# Altium project MainBoard.PrjPCB
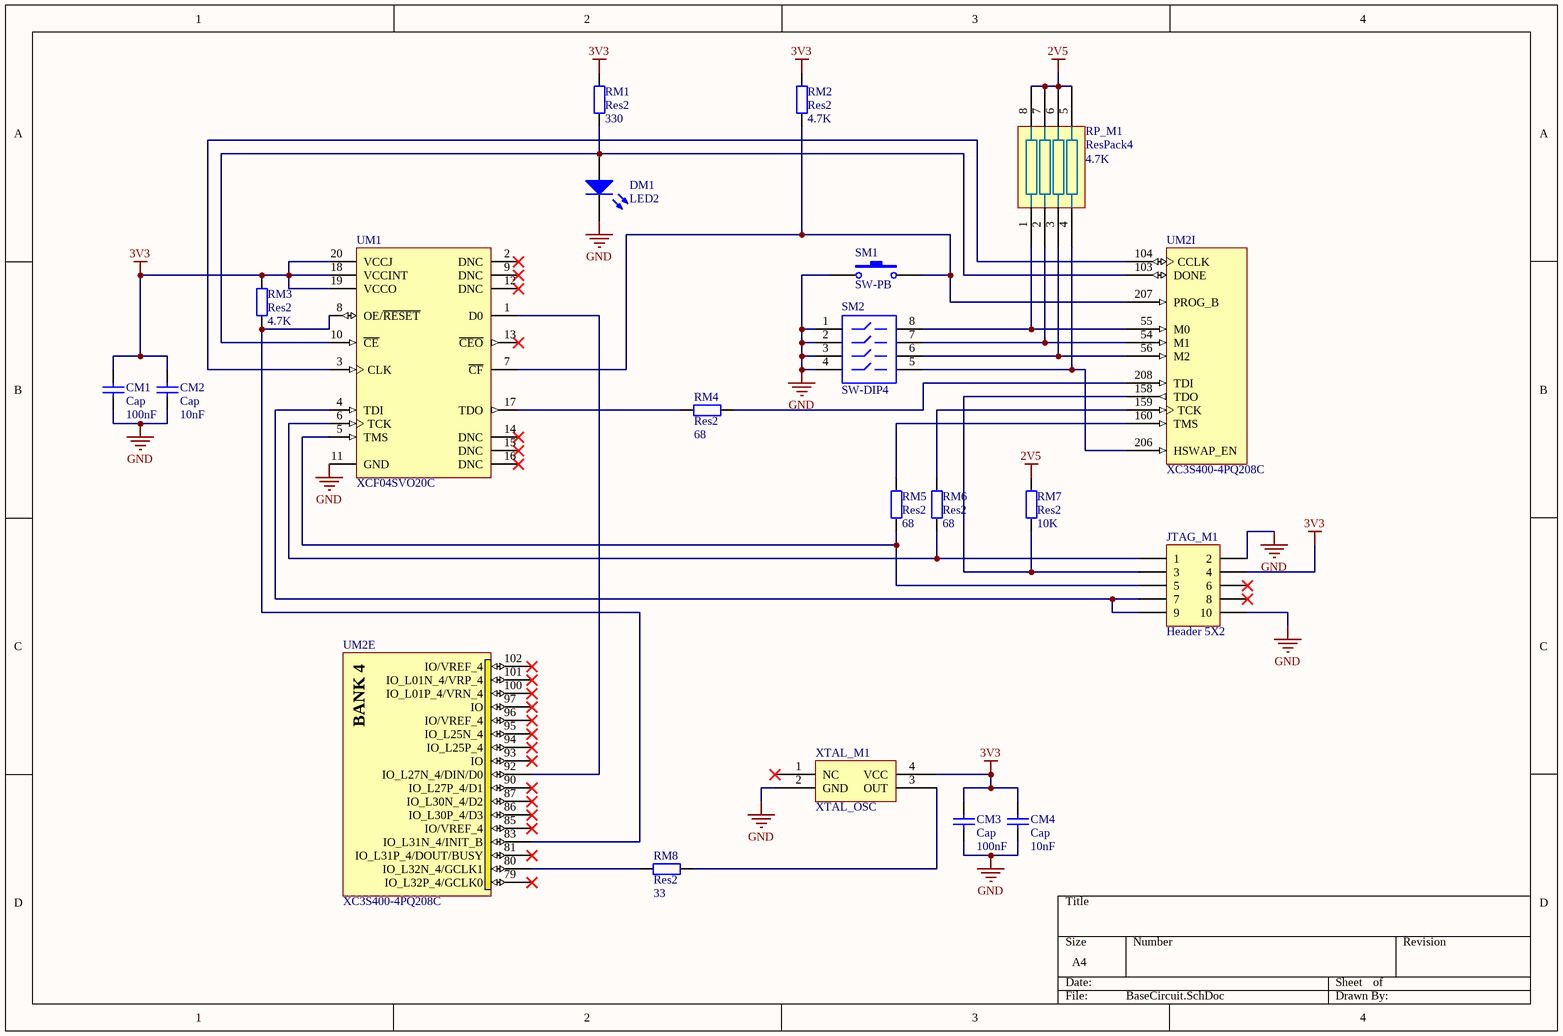
[diagram p0: BaseCircuit.SchDoc]
4 sheets, 81 parts. Net scope: global (net labels, ports and power ports of the same name join across sheets).
Board file: MainBoard4.PcbDoc
Sheets:
  BaseCircuit.SchDoc
  Banks.SchDoc
  PowerGnd.SchDoc
  Supply.SchDoc

## Sheet BaseCircuit.SchDoc
size A4; SheetNumber: 1

### Parts
CM1  Cap  value 100nF  [C0805]
CM2  Cap  value 10nF  [C0805]
CM3  Cap  value 100nF  [C0805]
CM4  Cap  value 10nF  [C0805]
DM1  LED2  [3.2X1.6X1.1]
JTAG_M1  Header 5X2  [HDR2X5]
RM1  Res2  value 330  [6-0805_N]
RM2  Res2  value 4.7K  [6-0805_N]
RM3  Res2  value 4.7K  [6-0805_N]
RM4  Res2  value 68  [6-0805_N]
RM5  Res2  value 68  [6-0805_N]
RM6  Res2  value 68  [6-0805_N]
RM7  Res2  value 10K  [6-0805_N]
RM8  Res2  value 33  [6-0805_N]
RP_M1  ResPack4  value 4.7K  [SSOP8]
SM1  SW-PB  [SPST-2]
SM2  SW-DIP4  [DIP-8]
UM1  XCF04SVO20C  [VO20_N]
UM2  XC3S400-4PQ208C  [PQ208_N]  (parts E,I of 11)
XTAL_M1  XTAL_OSC  [XTAL_HALF]

### Nets
2V5: RM7.2 RP_M1.5 RP_M1.6 RP_M1.7 RP_M1.8
3V3: CM1.2 CM2.2 CM3.2 CM4.2 JTAG_M1.4 RM1.2 RM2.2 RM3.2 UM1.18(VCCINT) UM1.19(VCCO) UM1.20(VCCJ) XTAL_M1.4(VCC)
GND: CM1.1 CM2.1 CM3.1 CM4.1 DM1.2(K) JTAG_M1.2 JTAG_M1.10 SM1.1 SM2.1 SM2.2 SM2.3 SM2.4 UM1.11(GND) XTAL_M1.2(GND)
NetDM1_1: DM1.1(A) RM1.1 UM1.10(~{CE}) UM2.103(DONE)
NetJTAG_M1_1: JTAG_M1.1 RM6.1 UM1.6(TCK)
NetJTAG_M1_3: JTAG_M1.3 RM7.1 UM2.158(TDO)
NetJTAG_M1_5: JTAG_M1.5 RM5.1 UM1.5(TMS)
NetJTAG_M1_7: JTAG_M1.7 JTAG_M1.9 UM1.4(TDI)
NetRM2_1: RM2.1 SM1.2 UM1.7(~{CF}) UM2.207(PROG_B)
NetRM3_1: RM3.1 UM1.8(OE/~{RESET}) UM2.83(IO_L31N_4/INIT_B)
NetRM4_1: RM4.1 UM2.208(TDI)
NetRM4_2: RM4.2 UM1.17(TDO)
NetRM5_2: RM5.2 UM2.160(TMS)
NetRM6_2: RM6.2 UM2.159(TCK)
NetRM8_1: RM8.1 XTAL_M1.3(OUT)
NetRM8_2: RM8.2 UM2.80(IO_L32N_4/GCLK1)
NetRP_M1_1: RP_M1.1 SM2.8 UM2.55(M0)
NetRP_M1_2: RP_M1.2 SM2.7 UM2.54(M1)
NetRP_M1_3: RP_M1.3 SM2.6 UM2.56(M2)
NetRP_M1_4: RP_M1.4 SM2.5 UM2.206(HSWAP_EN)
NetUM1_1: UM1.1(D0) UM2.92(IO_L27N_4/DIN/D0)
NetUM1_3: UM1.3(CLK) UM2.104(CCLK)

Not connected (* = marked no-connect by the designer): JTAG_M1 6* 8*; UM1 2(DNC)* 9(DNC)* 12(DNC)* 13(~{CEO})* 14(DNC)* 15(DNC)* 16(DNC)*; UM2 79(IO_L32P_4/GCLK0)* 81(IO_L31P_4/DOUT/BUSY)* 85(IO/VREF_4)* 86(IO_L30P_4/D3)* 87(IO_L30N_4/D2)* 90(IO_L27P_4/D1)* 93(IO)* 94(IO_L25P_4)* 95(IO_L25N_4)* 96(IO/VREF_4)* 97(IO)* 100(IO_L01P_4/VRN_4)* 101(IO_L01N_4/VRP_4)* 102(IO/VREF_4)*; XTAL_M1 1(NC)*

### Notes on the sheet
- (in symbol XC3S400-4PQ208C, part E) BANK 4

### Library data of the parts
CM1-CM4 = Cap: Capacitor; Published: 8-Jun-2000; LatestRevisionDate: 17-Jul-2002; LatestRevisionNote: Re-released for DXP Platform.; PackageReference: RAD-0.3; Publisher: Altium Limited; PackageDescription: Radial Cap, Thru-Hole; 2 Leads; 0.3 in Pin Spacing
DM1 = LED2: Typical RED, GREEN, YELLOW, AMBER GaAs LED; Published: 8-Jun-2000; LatestRevisionDate: 17-Jul-2002; LatestRevisionNote: Re-released for DXP Platform.; PackageVersion: Feb-2002; PackageReference: 3.2X1.6X1.1; Publisher: Altium Limited; PackageDescription: SM LED; 2 Flat Leads
JTAG_M1 = Header 5X2: Header, 5-Pin, Dual row; LatestRevisionDate: 17-Jul-2002; LatestRevisionNote: Re-released for DXP Platform.; Publisher: Altium Limited
RM1-RM8 = Res2: Resistor; Published: 8-Jun-2000; LatestRevisionDate: 17-Jul-2002; LatestRevisionNote: Re-released for DXP Platform.; PackageReference: AXIAL-0.4; Publisher: Altium Limited; PackageDescription: Axial Device, Thru-Hole; 2 Leads; 0.4 in Pin Spacing
SM1 = SW-PB: Switch; Published: 24-Mar-1999; LatestRevisionDate: 17-Jul-2002; LatestRevisionNote: Re-released for DXP Platform.; PackageReference: SPST-2; Publisher: Altium Limited; PackageDescription: Switch; 2 Leads
SM2 = SW-DIP4: DIP Switch; Published: 24-Mar-1999; LatestRevisionDate: 17-Jul-2002; LatestRevisionNote: Re-released for DXP Platform.; PackageReference: DIP-8; Publisher: Altium Limited
UM1 = XCF04SVO20C: XCF00S Series, Platform Flash In-System Programmable Configuration 3.3V PROM, 20-Pin TSOP, 4-Megabit, Commercial Grade; Published: 17-Sep-2003; LatestRevisionDate: 16-Nov-2009; LatestRevisionNote: Updated to datasheet version 2.17, Oct-2009.; DatasheetVersion: ver2.17, Oct-2009; PackageVersion: ver1.3, Dec-2008; PackageReference: VO20; Publisher: Altium Limited; PackageDescription: 20-Pin Thin Shrink Small Outline Package (VO20); Supplier 1: Digi-Key; Supplier Part Number 1: XCF04SVO20C-ND; Code_JEDEC: MO-153-AC; ComponentLink1Description: Platform Flash Datasheet; ComponentLink1URL: http://www.xilinx.com/support/documentation/data_sheets/ds123.pdf; ComponentLink2Description: VO20 Package Drawing; ComponentLink2URL: http://www.xilinx.com/support/documentation/package_specs/vo20.pdf; ComponentLink3Description: Configuration PROM Documents; ComponentLink3URL: http://www.xilinx.com/support/documentation/configuration_proms.htm; ComponentLink4Description: Xilinx.com Home; ComponentLink4URL: http://www.xilinx.com
UM2 = XC3S400-4PQ208C: Spartan-3 1.2V FPGA, 141 User I/Os, 208-Pin PQFP, Standard Performance, Commercial Grade; OrderingInformation: Additional code may have to be appended for different mask revision devices.; Published: 17-Sep-2003; LatestRevisionDate: 01-Mar-2010; LatestRevisionNote: Updated to datasheet version 2.5 Dec-2009.; DatasheetVersion: ver2.5, Dec-2009; PackageVersion: ver1.2, Jun-2004; PackageReference: PQ208; Publisher: Altium Limited; PackageDescription: 208-Pin Plastic Quad Flat Pack (PQ208); Supplier 1: Digi-Key; Supplier Part Number 1: XC3S400-4PQ208C-ND; Code_JEDEC: MS-029-FA-1; ComponentLink1Description: Spartan-3 Datasheet; ComponentLink1URL: http://www.xilinx.com/support/documentation/data_sheets/ds099.pdf; ComponentLink2Description: PQ208 Package Drawing; ComponentLink2URL: http://www.xilinx.com/support/documentation/package_specs/pq208.pdf; ComponentLink3Description: Spartan-3 Documents; ComponentLink3URL: http://www.xilinx.com/support/documentation/spartan-3.htm; ComponentLink4Description: Xilinx.com Home; ComponentLink4URL: http://www.xilinx.com

## Sheet Banks.SchDoc
size A4; SheetNumber: 2; SheetTotal: 4
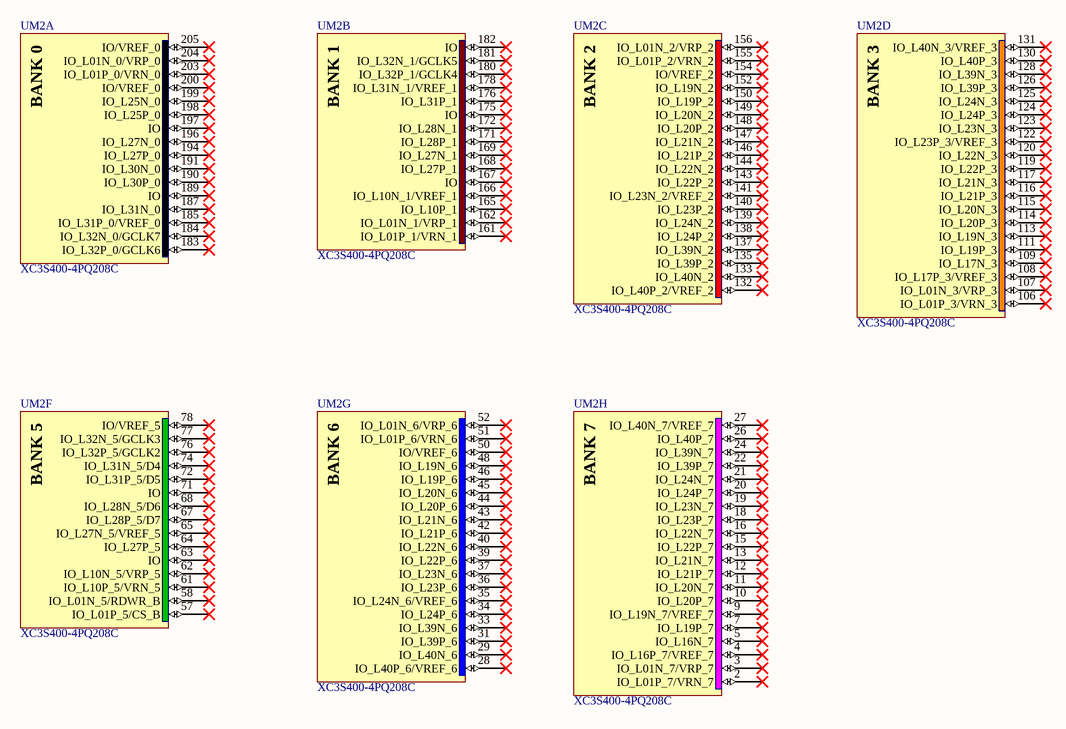
[diagram p1: Banks.SchDoc]

### Parts
UM2  XC3S400-4PQ208C  [PQ208_N]  (parts A,B,C,D,F,G,H of 11)

### Nets

Not connected (* = marked no-connect by the designer): UM2 2(IO_L01P_7/VRN_7)* 3(IO_L01N_7/VRP_7)* 4(IO_L16P_7/VREF_7)* 5(IO_L16N_7)* 7(IO_L19P_7)* 9(IO_L19N_7/VREF_7)* 10(IO_L20P_7)* 11(IO_L20N_7)* 12(IO_L21P_7)* 13(IO_L21N_7)* 15(IO_L22P_7)* 16(IO_L22N_7)* 18(IO_L23P_7)* 19(IO_L23N_7)* 20(IO_L24P_7)* 21(IO_L24N_7)* 22(IO_L39P_7)* 24(IO_L39N_7)* 26(IO_L40P_7)* 27(IO_L40N_7/VREF_7)* 28(IO_L40P_6/VREF_6)* 29(IO_L40N_6)* 31(IO_L39P_6)* 33(IO_L39N_6)* 34(IO_L24P_6)* 35(IO_L24N_6/VREF_6)* 36(IO_L23P_6)* 37(IO_L23N_6)* 39(IO_L22P_6)* 40(IO_L22N_6)* 42(IO_L21P_6)* 43(IO_L21N_6)* 44(IO_L20P_6)* 45(IO_L20N_6)* 46(IO_L19P_6)* 48(IO_L19N_6)* 50(IO/VREF_6)* 51(IO_L01P_6/VRN_6)* 52(IO_L01N_6/VRP_6)* 57(IO_L01P_5/CS_B)* 58(IO_L01N_5/RDWR_B)* 61(IO_L10P_5/VRN_5)* 62(IO_L10N_5/VRP_5)* 63(IO)* 64(IO_L27P_5)* 65(IO_L27N_5/VREF_5)* 67(IO_L28P_5/D7)* 68(IO_L28N_5/D6)* 71(IO)* 72(IO_L31P_5/D5)* 74(IO_L31N_5/D4)* 76(IO_L32P_5/GCLK2)* 77(IO_L32N_5/GCLK3)* 78(IO/VREF_5)* 106(IO_L01P_3/VRN_3)* 107(IO_L01N_3/VRP_3)* 108(IO_L17P_3/VREF_3)* 109(IO_L17N_3)* 111(IO_L19P_3)* 113(IO_L19N_3)* 114(IO_L20P_3)* 115(IO_L20N_3)* 116(IO_L21P_3)* 117(IO_L21N_3)* 119(IO_L22P_3)* 120(IO_L22N_3)* 122(IO_L23P_3/VREF_3)* 123(IO_L23N_3)* 124(IO_L24P_3)* 125(IO_L24N_3)* 126(IO_L39P_3)* 128(IO_L39N_3)* 130(IO_L40P_3)* 131(IO_L40N_3/VREF_3)* 132(IO_L40P_2/VREF_2)* 133(IO_L40N_2)* 135(IO_L39P_2)* 137(IO_L39N_2)* 138(IO_L24P_2)* 139(IO_L24N_2)* 140(IO_L23P_2)* 141(IO_L23N_2/VREF_2)* 143(IO_L22P_2)* 144(IO_L22N_2)* 146(IO_L21P_2)* 147(IO_L21N_2)* 148(IO_L20P_2)* 149(IO_L20N_2)* 150(IO_L19P_2)* 152(IO_L19N_2)* 154(IO/VREF_2)* 155(IO_L01P_2/VRN_2)* 156(IO_L01N_2/VRP_2)* 161(IO_L01P_1/VRN_1)* 162(IO_L01N_1/VRP_1)* 165(IO_L10P_1)* 166(IO_L10N_1/VREF_1)* 167(IO)* 168(IO_L27P_1)* 169(IO_L27N_1)* 171(IO_L28P_1)* 172(IO_L28N_1)* 175(IO)* 176(IO_L31P_1)* 178(IO_L31N_1/VREF_1)* 180(IO_L32P_1/GCLK4)* 181(IO_L32N_1/GCLK5)* 182(IO)* 183(IO_L32P_0/GCLK6)* 184(IO_L32N_0/GCLK7)* 185(IO_L31P_0/VREF_0)* 187(IO_L31N_0)* 189(IO)* 190(IO_L30P_0)* 191(IO_L30N_0)* 194(IO_L27P_0)* 196(IO_L27N_0)* 197(IO)* 198(IO_L25P_0)* 199(IO_L25N_0)* 200(IO/VREF_0)* 203(IO_L01P_0/VRN_0)* 204(IO_L01N_0/VRP_0)* 205(IO/VREF_0)*

### Notes on the sheet
- (in symbol XC3S400-4PQ208C, part A) BANK 0
- (in symbol XC3S400-4PQ208C, part B) BANK 1
- (in symbol XC3S400-4PQ208C, part C) BANK 2
- (in symbol XC3S400-4PQ208C, part D) BANK 3
- (in symbol XC3S400-4PQ208C, part F) BANK 5
- (in symbol XC3S400-4PQ208C, part G) BANK 6
- (in symbol XC3S400-4PQ208C, part H) BANK 7

### Library data of the parts
UM2 = XC3S400-4PQ208C: as UM2 on sheet BaseCircuit; Published: 17-Sep-2003; LatestRevisionDate: 01-Mar-2010; LatestRevisionNote: Updated to datasheet version 2.5 Dec-2009.; DatasheetVersion: ver2.5, Dec-2009; PackageVersion: ver1.2, Jun-2004; PackageReference: PQ208; Publisher: Altium Limited; PackageDescription: 208-Pin Plastic Quad Flat Pack (PQ208); Supplier 1: Digi-Key; Supplier Part Number 1: XC3S400-4PQ208C-ND; Code_JEDEC: MS-029-FA-1; ComponentLink1Description: Spartan-3 Datasheet; ComponentLink1URL: http://www.xilinx.com/support/documentation/data_sheets/ds099.pdf; ComponentLink2Description: PQ208 Package Drawing; ComponentLink2URL: http://www.xilinx.com/support/documentation/package_specs/pq208.pdf; ComponentLink3Description: Spartan-3 Documents; ComponentLink3URL: http://www.xilinx.com/support/documentation/spartan-3.htm; ComponentLink4Description: Xilinx.com Home; ComponentLink4URL: http://www.xilinx.com

## Sheet PowerGnd.SchDoc
size A4; SheetNumber: 3; SheetTotal: 4
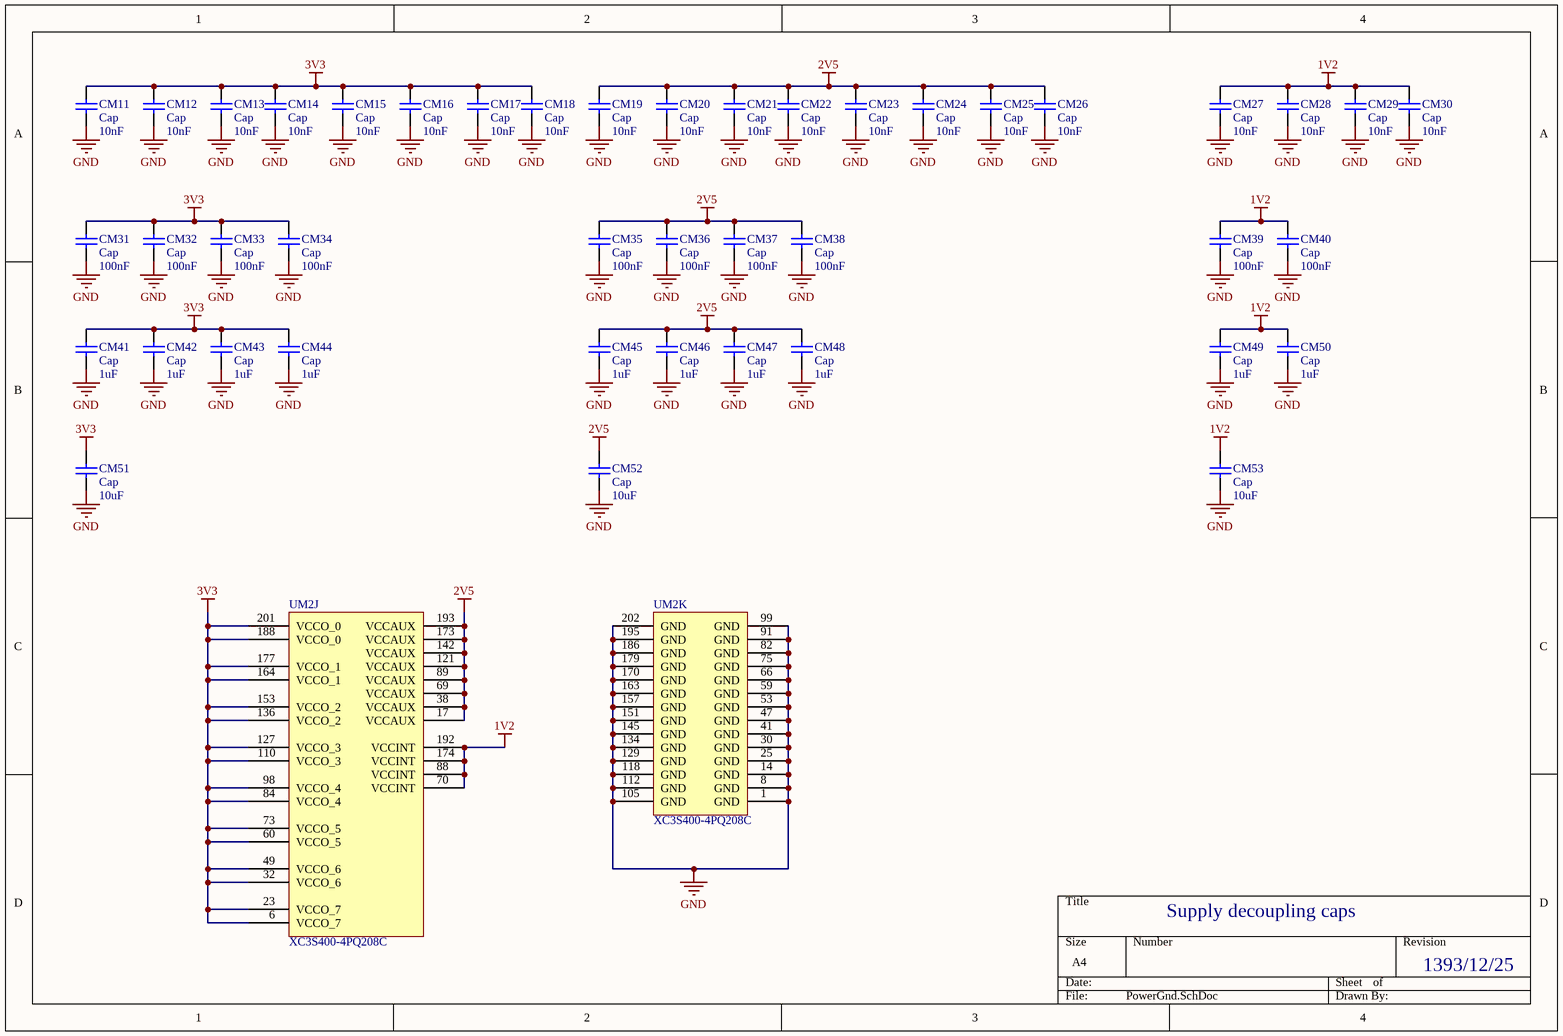
[diagram p2: PowerGnd.SchDoc]

### Parts
CM11  Cap  value 10nF  [C0805]
CM12  Cap  value 10nF  [C0805]
CM13  Cap  value 10nF  [C0805]
CM14  Cap  value 10nF  [C0805]
CM15  Cap  value 10nF  [C0805]
CM16  Cap  value 10nF  [C0805]
CM17  Cap  value 10nF  [C0805]
CM18  Cap  value 10nF  [C0805]
CM19  Cap  value 10nF  [C0805]
CM20  Cap  value 10nF  [C0805]
CM21  Cap  value 10nF  [C0805]
CM22  Cap  value 10nF  [C0805]
CM23  Cap  value 10nF  [C0805]
CM24  Cap  value 10nF  [C0805]
CM25  Cap  value 10nF  [C0805]
CM26  Cap  value 10nF  [C0805]
CM27  Cap  value 10nF  [C0805]
CM28  Cap  value 10nF  [C0805]
CM29  Cap  value 10nF  [C0805]
CM30  Cap  value 10nF  [C0805]
CM31  Cap  value 100nF  [C0805]
CM32  Cap  value 100nF  [C0805]
CM33  Cap  value 100nF  [C0805]
CM34  Cap  value 100nF  [C0805]
CM35  Cap  value 100nF  [C0805]
CM36  Cap  value 100nF  [C0805]
CM37  Cap  value 100nF  [C0805]
CM38  Cap  value 100nF  [C0805]
CM39  Cap  value 100nF  [C0805]
CM40  Cap  value 100nF  [C0805]
CM41  Cap  value 1uF  [C0805]
CM42  Cap  value 1uF  [C0805]
CM43  Cap  value 1uF  [C0805]
CM44  Cap  value 1uF  [C0805]
CM45  Cap  value 1uF  [C0805]
CM46  Cap  value 1uF  [C0805]
CM47  Cap  value 1uF  [C0805]
CM48  Cap  value 1uF  [C0805]
CM49  Cap  value 1uF  [C0805]
CM50  Cap  value 1uF  [C0805]
CM51  Cap  value 10uF  [C0805]
CM52  Cap  value 10uF  [C0805]
CM53  Cap  value 10uF  [C0805]
UM2  XC3S400-4PQ208C  [PQ208_N]  (parts J,K of 11)

### Nets
1V2: CM27.2 CM28.2 CM29.2 CM30.2 CM39.2 CM40.2 CM49.2 CM50.2 CM53.2 UM2.70(VCCINT) UM2.88(VCCINT) UM2.174(VCCINT) UM2.192(VCCINT)
2V5: CM19.2 CM20.2 CM21.2 CM22.2 CM23.2 CM24.2 CM25.2 CM26.2 CM35.2 CM36.2 CM37.2 CM38.2 CM45.2 CM46.2 CM47.2 CM48.2 CM52.2 UM2.17(VCCAUX) UM2.38(VCCAUX) UM2.69(VCCAUX) UM2.89(VCCAUX) UM2.121(VCCAUX) UM2.142(VCCAUX) UM2.173(VCCAUX) UM2.193(VCCAUX)
3V3: CM11.2 CM12.2 CM13.2 CM14.2 CM15.2 CM16.2 CM17.2 CM18.2 CM31.2 CM32.2 CM33.2 CM34.2 CM41.2 CM42.2 CM43.2 CM44.2 CM51.2 UM2.6(VCCO_7) UM2.23(VCCO_7) UM2.32(VCCO_6) UM2.49(VCCO_6) UM2.60(VCCO_5) UM2.73(VCCO_5) UM2.84(VCCO_4) UM2.98(VCCO_4) UM2.110(VCCO_3) UM2.127(VCCO_3) UM2.136(VCCO_2) UM2.153(VCCO_2) UM2.164(VCCO_1) UM2.177(VCCO_1) UM2.188(VCCO_0) UM2.201(VCCO_0)
GND: CM11.1 CM12.1 CM13.1 CM14.1 CM15.1 CM16.1 CM17.1 CM18.1 CM19.1 CM20.1 CM21.1 CM22.1 CM23.1 CM24.1 CM25.1 CM26.1 CM27.1 CM28.1 CM29.1 CM30.1 CM31.1 CM32.1 CM33.1 CM34.1 CM35.1 CM36.1 CM37.1 CM38.1 CM39.1 CM40.1 CM41.1 CM42.1 CM43.1 CM44.1 CM45.1 CM46.1 CM47.1 CM48.1 CM49.1 CM50.1 CM51.1 CM52.1 CM53.1 UM2.1(GND) UM2.8(GND) UM2.14(GND) UM2.25(GND) UM2.30(GND) UM2.41(GND) UM2.47(GND) UM2.53(GND) UM2.59(GND) UM2.66(GND) UM2.75(GND) UM2.82(GND) UM2.91(GND) UM2.99(GND) UM2.105(GND) UM2.112(GND) UM2.118(GND) UM2.129(GND) UM2.134(GND) UM2.145(GND) UM2.151(GND) UM2.157(GND) UM2.163(GND) UM2.170(GND) UM2.179(GND) UM2.186(GND) UM2.195(GND) UM2.202(GND)

### Notes on the sheet
- Supply decoupling caps
- 1393/12/25

### Library data of the parts
CM11-CM53 = Cap: Capacitor; Published: 8-Jun-2000; LatestRevisionDate: 17-Jul-2002; LatestRevisionNote: Re-released for DXP Platform.; PackageReference: RAD-0.3; Publisher: Altium Limited; PackageDescription: Radial Cap, Thru-Hole; 2 Leads; 0.3 in Pin Spacing
UM2 = XC3S400-4PQ208C: as UM2 on sheet BaseCircuit; Published: 17-Sep-2003; LatestRevisionDate: 01-Mar-2010; LatestRevisionNote: Updated to datasheet version 2.5 Dec-2009.; DatasheetVersion: ver2.5, Dec-2009; PackageVersion: ver1.2, Jun-2004; PackageReference: PQ208; Publisher: Altium Limited; PackageDescription: 208-Pin Plastic Quad Flat Pack (PQ208); Supplier 1: Digi-Key; Supplier Part Number 1: XC3S400-4PQ208C-ND; Code_JEDEC: MS-029-FA-1; ComponentLink1Description: Spartan-3 Datasheet; ComponentLink1URL: http://www.xilinx.com/support/documentation/data_sheets/ds099.pdf; ComponentLink2Description: PQ208 Package Drawing; ComponentLink2URL: http://www.xilinx.com/support/documentation/package_specs/pq208.pdf; ComponentLink3Description: Spartan-3 Documents; ComponentLink3URL: http://www.xilinx.com/support/documentation/spartan-3.htm; ComponentLink4Description: Xilinx.com Home; ComponentLink4URL: http://www.xilinx.com

## Sheet Supply.SchDoc
size A; SheetNumber: 4; SheetTotal: 4
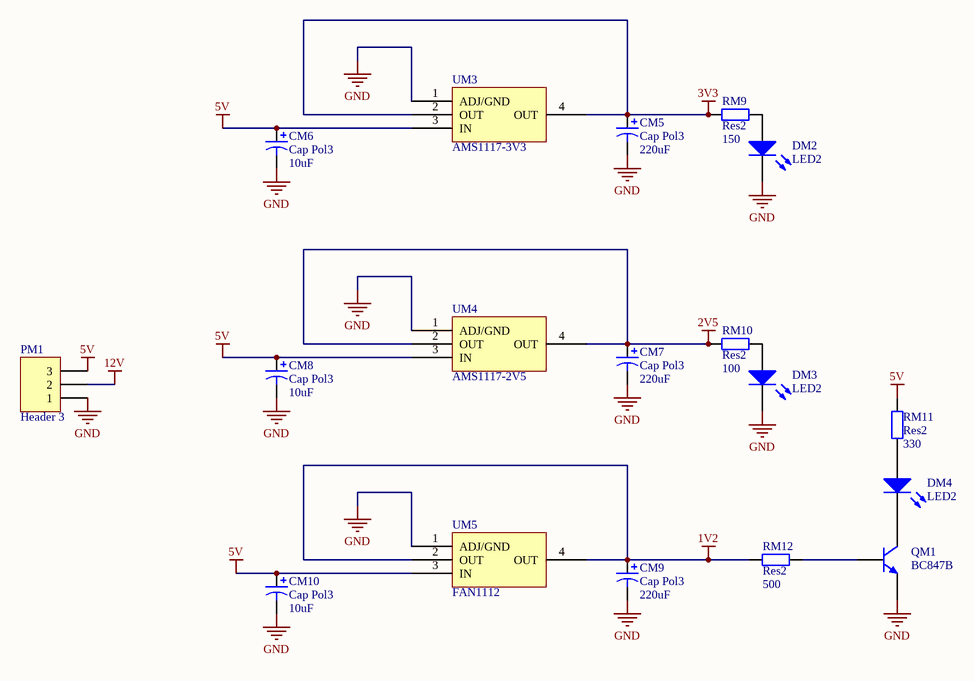
[diagram p3: Supply.SchDoc]

### Parts
CM5  Cap Pol3  value 220uF  [SIZE D]
CM6  Cap Pol3  value 10uF  [SIZE B]
CM7  Cap Pol3  value 220uF  [SIZE D]
CM8  Cap Pol3  value 10uF  [SIZE B]
CM9  Cap Pol3  value 220uF  [SIZE D]
CM10  Cap Pol3  value 10uF  [SIZE B]
DM2  LED2  [3.2X1.6X1.1]
DM3  LED2  [3.2X1.6X1.1]
DM4  LED2  [3.2X1.6X1.1]
PM1  Header 3  [HDR1X3]
QM1  BC847B  [SOT23_M]
RM9  Res2  value 150  [6-0805_N]
RM10  Res2  value 100  [6-0805_N]
RM11  Res2  value 330  [6-0805_N]
RM12  Res2  value 500  [6-0805_N]
UM3  AMS1117-3V3  [TO-252]
UM4  AMS1117-2V5  [TO-252]
UM5  FAN1112  [TO-252]

### Nets
1V2: CM9.1 RM12.1 UM5.2(OUT) UM5.4(OUT)
2V5: CM7.1 RM10.1 UM4.2(OUT) UM4.4(OUT)
3V3: CM5.1 RM9.1 UM3.2(OUT) UM3.4(OUT)
5V: CM6.1 CM8.1 CM10.1 PM1.3 RM11.2 UM3.3(IN) UM4.3(IN) UM5.3(IN)
12V: PM1.2
GND: CM5.2 CM6.2 CM7.2 CM8.2 CM9.2 CM10.2 DM2.2(K) DM3.2(K) PM1.1 QM1.3(E) UM3.1(ADJ/GND) UM4.1(ADJ/GND) UM5.1(ADJ/GND)
NetDM2_1: DM2.1(A) RM9.2
NetDM3_1: DM3.1(A) RM10.2
NetDM4_1: DM4.1(A) RM11.1
NetDM4_2: DM4.2(K) QM1.1(C)
NetQM1_2: QM1.2(B) RM12.2

### Library data of the parts
CM5-CM10 = Cap Pol3: Polarized Capacitor (Surface Mount); Published: 8-Jun-2000; LatestRevisionDate: 29-May-2009; LatestRevisionNote: IPC-7351 Footprint Added.; PackageReference: C0805; Publisher: Altium Limited; PackageDescription: Chip Capacitor
DM2-DM4 = LED2: as DM1 on sheet BaseCircuit; Published: 8-Jun-2000; LatestRevisionDate: 17-Jul-2002; LatestRevisionNote: Re-released for DXP Platform.; PackageVersion: Feb-2002; PackageReference: 3.2X1.6X1.1; Publisher: Altium Limited; PackageDescription: SM LED; 2 Flat Leads
PM1 = Header 3: Header, 3-Pin; LatestRevisionDate: 17-Jul-2002; LatestRevisionNote: Re-released for DXP Platform.; Publisher: Altium Limited
QM1 = NPN: NPN Bipolar Transistor; Published: 8-Jun-2000; LatestRevisionDate: 17-Jul-2002; LatestRevisionNote: Re-released for DXP Platform.; PackageReference: TO-226-AA; Publisher: Altium Limited; PackageDescription: TO, Flat Index; 3 In-Line, Axial Leads; Body Dia. 4.8mm; Leads 0.55 x 0.51 mm (max); Code_JEDEC: TO-226-AA
RM9-RM12 = Res2: Resistor; Published: 8-Jun-2000; LatestRevisionDate: 17-Jul-2002; LatestRevisionNote: Re-released for DXP Platform.; PackageReference: AXIAL-0.4; Publisher: Altium Limited; PackageDescription: Axial Device, Thru-Hole; 2 Leads; 0.4 in Pin Spacing
UM3-UM5 = AMS1117-3.3V

## Nets that join several sheets
1V2: PowerGnd (13 pins), Supply (CM9.1 RM12.1 UM5.2 UM5.4)
2V5: BaseCircuit (5 pins), PowerGnd (25 pins), Supply (CM7.1 RM10.1 UM4.2 UM4.4)
3V3: BaseCircuit (12 pins), PowerGnd (33 pins), Supply (CM5.1 RM9.1 UM3.2 UM3.4)
GND: BaseCircuit (14 pins), PowerGnd (71 pins), Supply (13 pins)